# EAGLE design lc filter final (EAGLE 7.6.0)
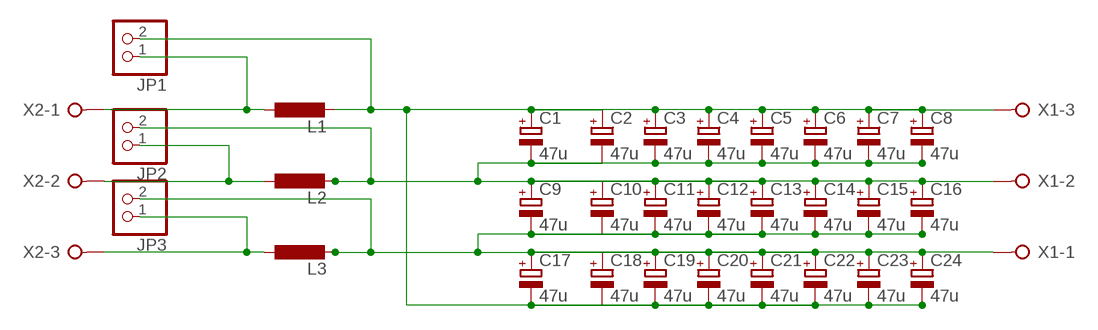
[diagram p0: schematic, sheet 1]

## Parts
C1  47u  CPOL-EUE5-10.5  [E5-10,5]
C2  47u  CPOL-EUE5-10.5  [E5-10,5]
C3  47u  CPOL-EUE5-10.5  [E5-10,5]
C4  47u  CPOL-EUE5-10.5  [E5-10,5]
C5  47u  CPOL-EUE5-10.5  [E5-10,5]
C6  47u  CPOL-EUE5-10.5  [E5-10,5]
C7  47u  CPOL-EUE5-10.5  [E5-10,5]
C8  47u  CPOL-EUE5-10.5  [E5-10,5]
C9  47u  CPOL-EUE5-10.5  [E5-10,5]
C10  47u  CPOL-EUE5-10.5  [E5-10,5]
C11  47u  CPOL-EUE5-10.5  [E5-10,5]
C12  47u  CPOL-EUE5-10.5  [E5-10,5]
C13  47u  CPOL-EUE5-10.5  [E5-10,5]
C14  47u  CPOL-EUE5-10.5  [E5-10,5]
C15  47u  CPOL-EUE5-10.5  [E5-10,5]
C16  47u  CPOL-EUE5-10.5  [E5-10,5]
C17  47u  CPOL-EUE5-10.5  [E5-10,5]
C18  47u  CPOL-EUE5-10.5  [E5-10,5]
C19  47u  CPOL-EUE5-10.5  [E5-10,5]
C20  47u  CPOL-EUE5-10.5  [E5-10,5]
C21  47u  CPOL-EUE5-10.5  [E5-10,5]
C22  47u  CPOL-EUE5-10.5  [E5-10,5]
C23  47u  CPOL-EUE5-10.5  [E5-10,5]
C24  47u  CPOL-EUE5-10.5  [E5-10,5]
JP1  PINHD-1X2  [1X02]
JP2  PINHD-1X2  [1X02]
JP3  PINHD-1X2  [1X02]
L1  L-EU6000-XXX-RC  [6000-XXXX-RC]
L2  L-EU6000-XXX-RC  [6000-XXXX-RC]
L3  L-EU6000-XXX-RC  [6000-XXXX-RC]
X1  W237-03P  [W237-133]
X2  W237-03P  [W237-133]

## Nets
N$1: JP1.1 L1.1 X2.1
N$2: C1.- C2.- C3.- C4.- C5.- C6.- C7.- C8.- C9.+ C10.+ C11.+ C12.+ C13.+ C14.+ C15.+ C16.+ JP2.2 L2.2 X1.2
N$3: JP2.1 L2.1 X2.2
N$4: C9.- C10.- C11.- C12.- C13.- C14.- C15.- C16.- C17.+ C18.+ C19.+ C20.+ C21.+ C22.+ C23.+ C24.+ JP3.2 L3.2 X1.1
N$5: JP3.1 L3.1 X2.3
N$6: C1.+ C2.+ C3.+ C4.+ C5.+ C6.+ C7.+ C8.+ C17.- C18.- C19.- C20.- C21.- C22.- C23.- C24.- JP1.2 L1.2 X1.3

## Library data of the parts
C1-C24 = rcl:CPOL-EU: POLARIZED CAPACITOR, European symbol
JP1-JP3 = pinhead:PINHD-1X2: PIN HEADER
L1-L3 = rcl:L-EU: INDUCTOR, European symbol
X1 X2 = con-wago-508:W237-03P: WAGO SREW CLAMP; OC_FARNELL: unknown; OC_NEWARK: unknown

## Net classes
0 default: width 1.524 mm, clearance 0.381 mm

## Board
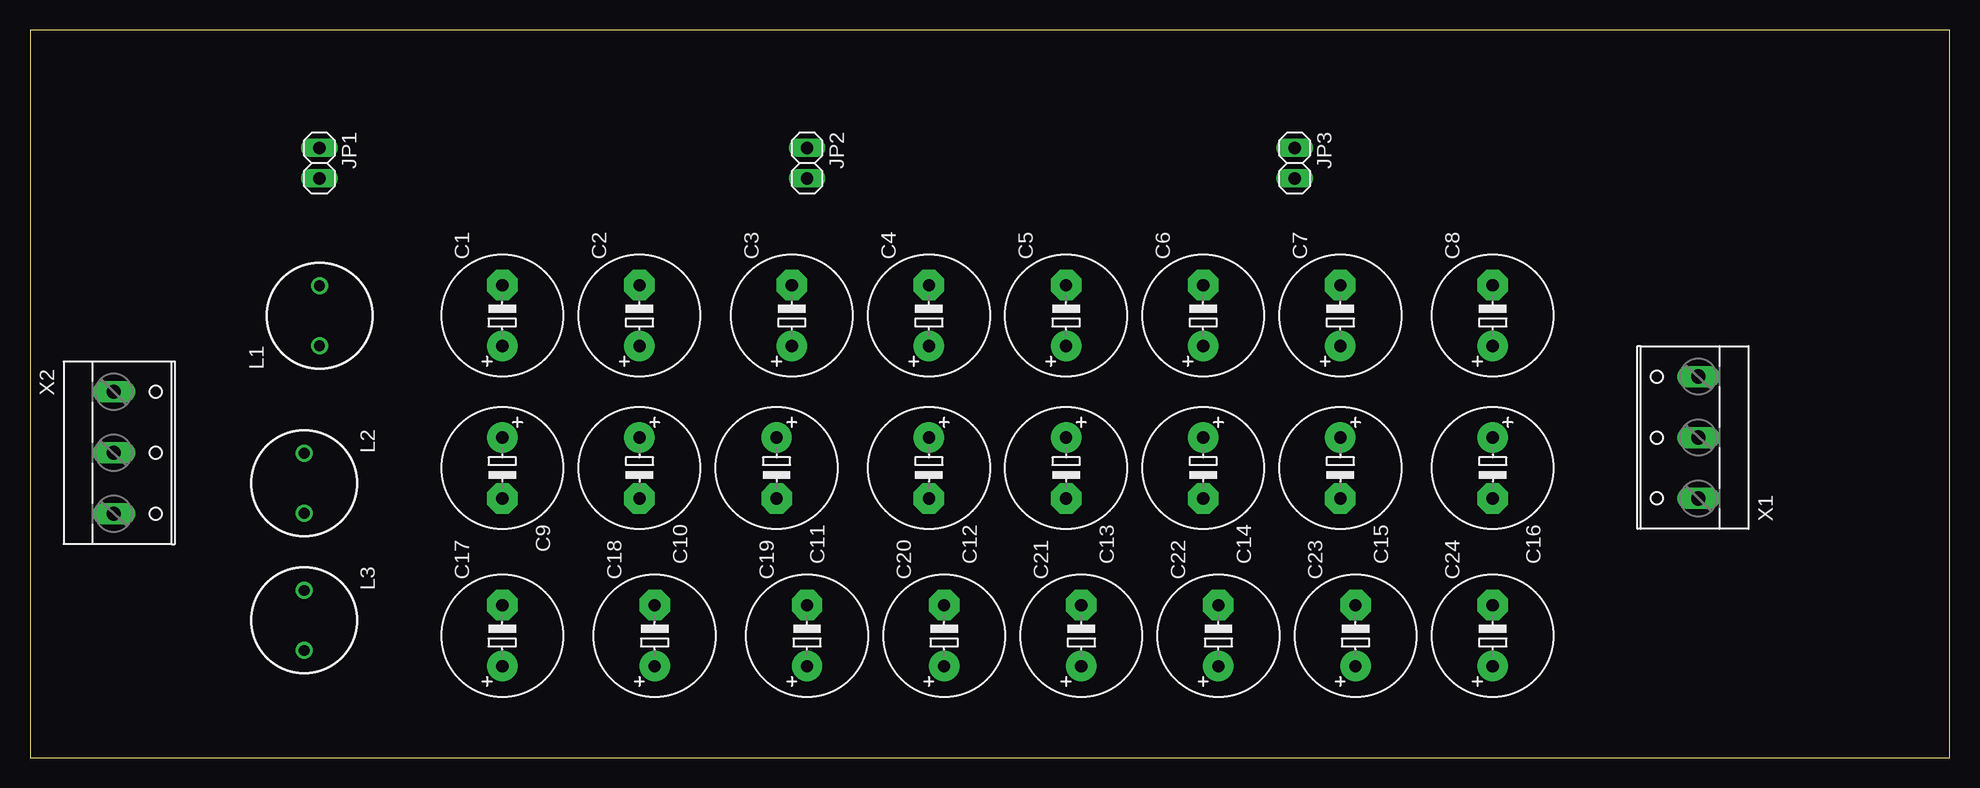
[diagram p1: board, top side]
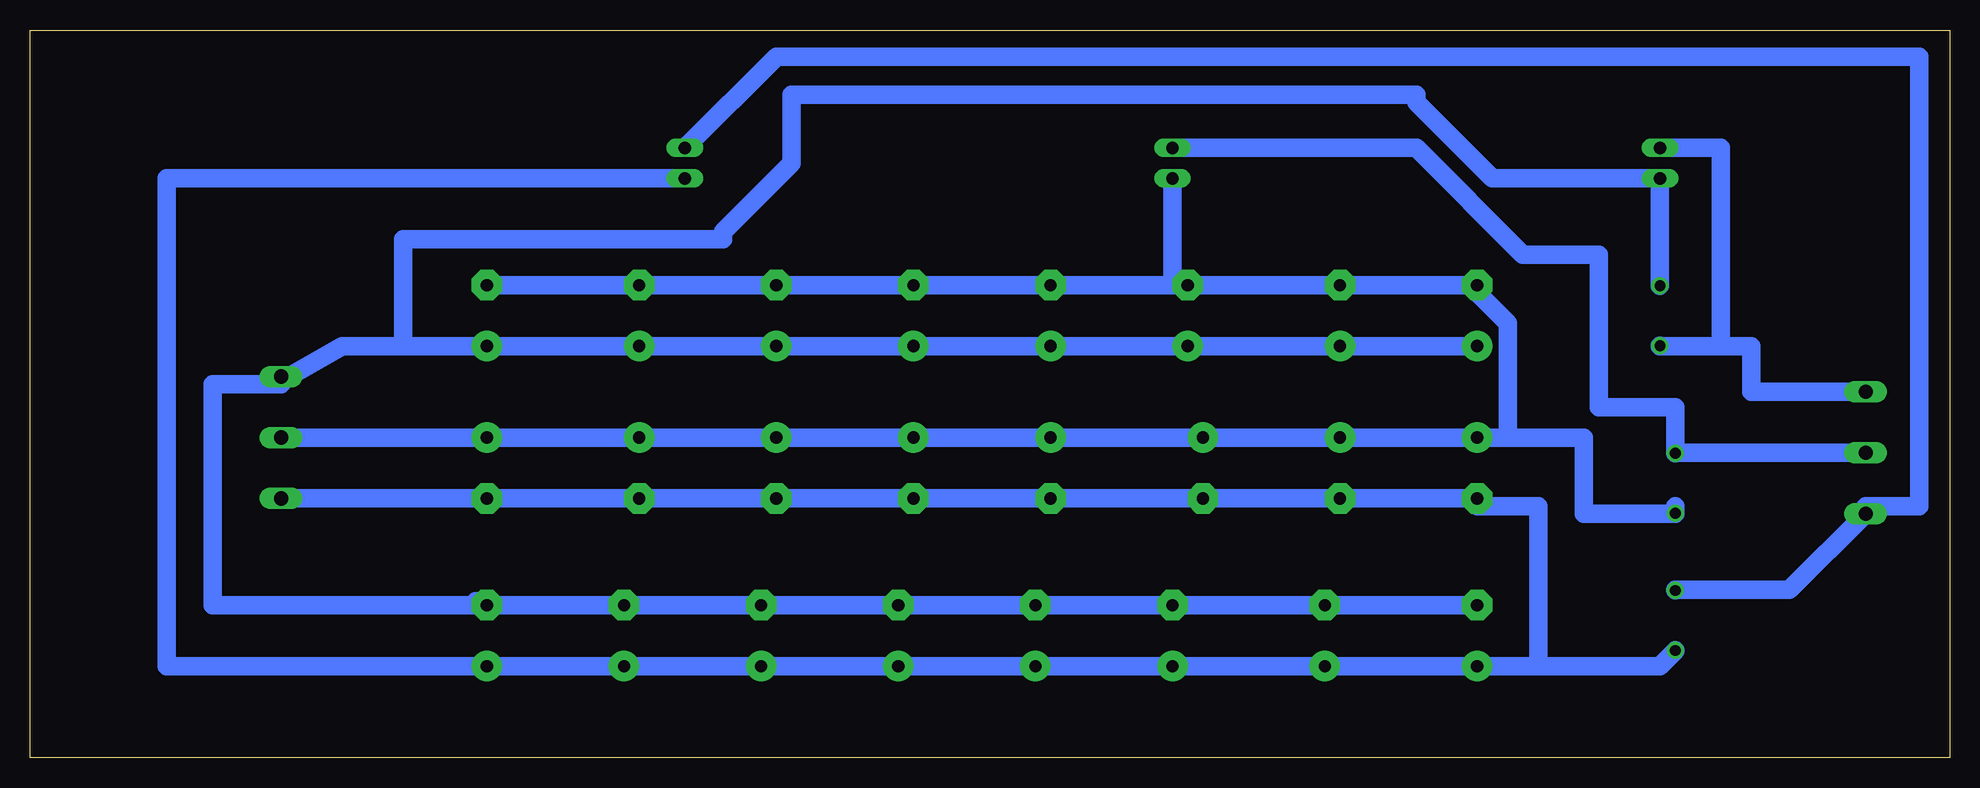
[diagram p2: board, bottom side, seen from below]

Size 160 x 60.63 mm. Coordinates in mm from the lower left corner, seen from the top.
Outline: 0,0 160,0 160,60.63 0,60.63 0,0
Copper layers (1*16): Top 0.035mm / dielectric 1.5mm / Bottom 0.035mm
Design rules "default": minimum track width 10mil, minimum drill 24mil, track to track 8mil, track to pad 8mil, pad to pad 8mil, via to via 8mil, smd to smd 8mil, copper to edge 40mil, drill to drill 8mil, minimum pad ring 10mil, minimum via ring 8mil, stop-mask expansion 4mil, vias tented up to drill 0mil, thermal gap 10mil

### Footprints (pad centres in the part's own frame; a part is rotated, then mirrored left to right if it is on the bottom)
E5-10,5 = drill 1.016 pad 2.54: + -2.54,0 | drill 1.016 pad 2.54 octagon: - 2.54,0
1X02 = drill 1.016 long: 1 -1.27,0; 2 1.27,0
6000-XXXX-RC = drill 0.9 pad 1.422: 1 -2.5,0; 2 2.5,0
W237-133 = drill 1.194 long: 1 -5.08,-0.635; 2 0,-0.635; 3 5.08,-0.635

### Placement (x,y rotation side)
C1  39.37,36.83 90 top
C2  50.8,36.83 90 top
C3  63.5,36.83 90 top
C4  74.93,36.83 90 top
C5  86.36,36.83 90 top
C6  97.79,36.83 90 top
C7  109.22,36.83 90 top
C8  121.92,36.83 90 top
C9  39.37,24.13 270 top
C10  50.8,24.13 270 top
C11  62.23,24.13 270 top
C12  74.93,24.13 270 top
C13  86.36,24.13 270 top
C14  97.79,24.13 270 top
C15  109.22,24.13 270 top
C16  121.92,24.13 270 top
C17  39.37,10.16 90 top
C18  52.07,10.16 90 top
C19  64.77,10.16 90 top
C20  76.2,10.16 90 top
C21  87.63,10.16 90 top
C22  99.06,10.16 90 top
C23  110.49,10.16 90 top
C24  121.92,10.16 90 top
JP1  24.13,49.53 270 top
JP2  64.77,49.53 270 top
JP3  105.41,49.53 270 top
L1  24.13,36.83 90 top
L2  22.86,22.86 270 top
L3  22.86,11.43 270 top
X1  138.43,26.67 90 top
X2  7.62,25.4 270 top

### Tracks (layer width: path | path; a pad name or v marks a point on that pad's centre or on a via)
N$1
  Bottom 1.524: L1.1 24.13,34.29 19.05,34.29 | 19.05,34.29 16.51,34.29 16.51,30.48 X2.1 | JP1.1 19.05,50.8 19.05,34.29
N$2
  Bottom 1.524: 64.77,39.37 C3.- C2.- C1.- 39.37,38.73 36.83,36.2 36.83,26.67 | 64.77,39.37 C4.- C5.- C6.- C7.- C8.- | 36.83,26.67 C9.+ C10.+ C11.+ C12.+ C13.+ C14.+ C15.+ C16.+ X1.2 | 22.86,20.95 L2.2 22.86,20.32 30.48,20.32 30.48,26.67 36.83,26.67 | 64.77,39.37 JP2.2
N$3
  Bottom 1.524: X2.2 22.86,25.4 L2.1 22.86,29.21 29.21,29.21 29.21,41.91 35.56,41.91 44.45,50.8 JP2.1
N$4
  Bottom 1.524: X1.1 C16.- C15.- C14.- C13.- C12.- C11.- C10.- C9.- 39.37,20.95 34.29,20.95 34.29,7.62 | 34.29,7.62 C17.+ C18.+ C19.+ C20.+ C21.+ C22.+ C23.+ C24.+ 148.59,7.62 148.59,48.26 JP3.2 128.27,48.26 | 34.29,7.62 24.13,7.62 22.86,8.89 L3.2
N$5
  Bottom 1.524: L3.1 22.86,13.97 13.34,13.97 X2.3 6.99,20.95 2.54,20.95 2.54,58.42 26.67,58.42 27.94,58.42 97.79,58.42 JP3.1
N$6
  Bottom 1.524: C17.- C18.- C19.- C20.- C21.- C22.- C23.- C24.- 122.56,12.7 122.87,13.02 122.87,12.7 144.78,12.7 144.78,31.12 139.06,31.12 X1.3 138.43,31.75 133.99,34.29 128.91,34.29 | C1.+ C2.+ C3.+ C4.+ C5.+ C6.+ C7.+ C8.+ 128.91,34.29 | L1.2 JP1.2 38.1,48.26 44.45,54.61 44.45,55.24 96.52,55.24 96.52,49.53 102.23,43.82 102.23,43.18 128.91,43.18 128.91,34.29